# Altium schematic sheet Shutdown.SchDoc
size A
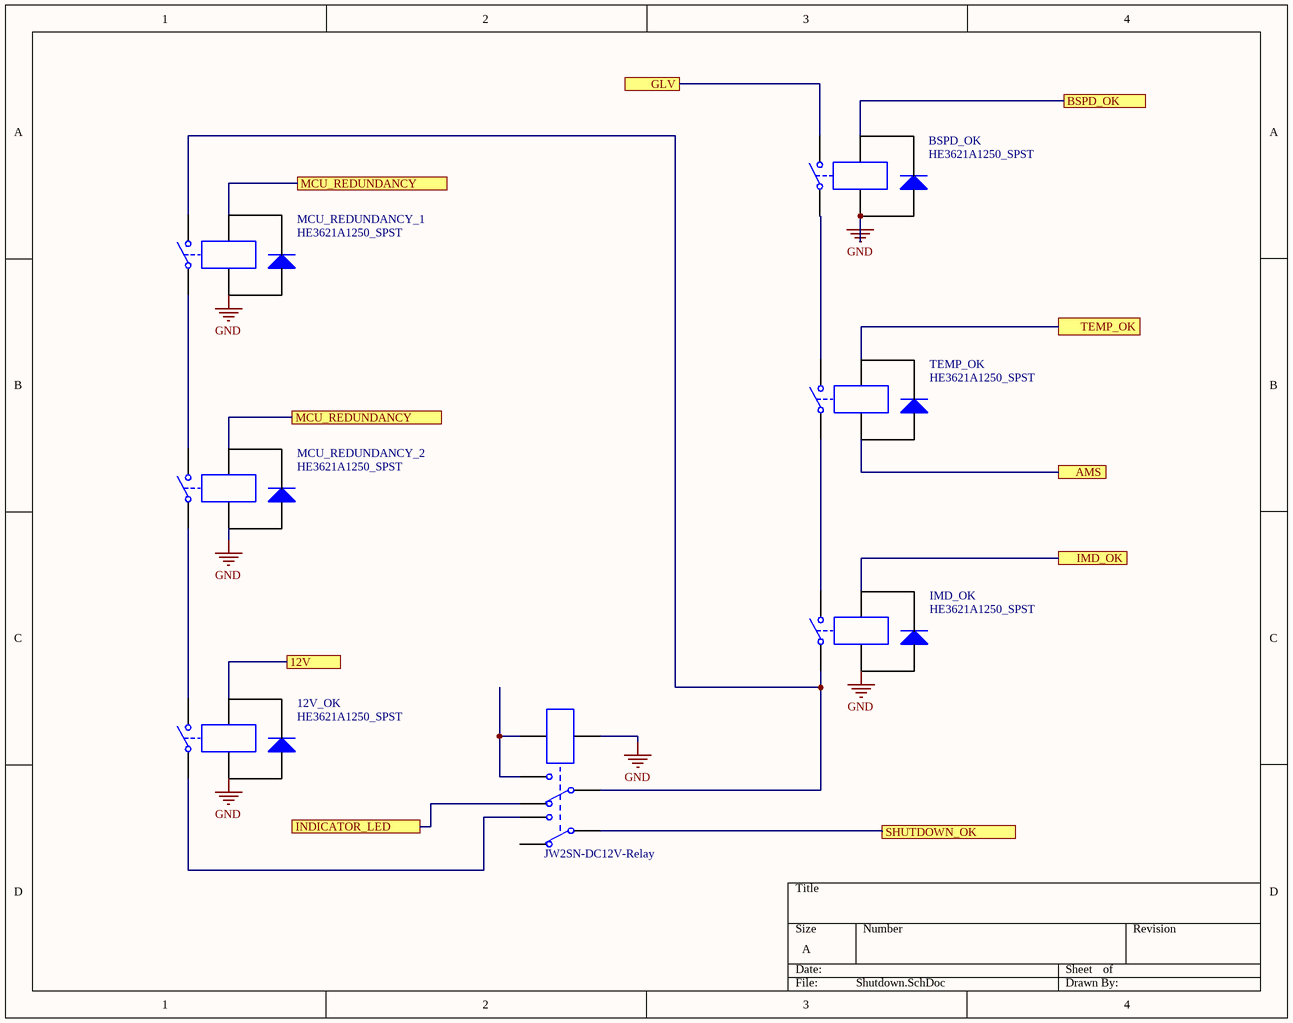
[diagram p0: Shutdown.SchDoc]

## Parts
12V_OK  HE3621A1250_SPST  [SIL]
?  JW2SN-DC12V-Relay  [JW2SN-DC12V-Relay]
BSPD_OK  HE3621A1250_SPST  [SIL]
IMD_OK  HE3621A1250_SPST  [SIL]
MCU_REDUNDANCY_1  HE3621A1250_SPST  [SIL]
MCU_REDUNDANCY_2  HE3621A1250_SPST  [SIL]
TEMP_OK  HE3621A1250_SPST  [SIL]

## Ports
12V, AMS, BSPD_OK, GLV, IMD_OK, INDICATOR_LED, MCU_REDUNDANCY, SHUTDOWN_OK, TEMP_OK

## Nets
GND: 12V_OK.3 ?.1(COIL1) BSPD_OK.3 IMD_OK.3 MCU_REDUNDANCY_1.3 MCU_REDUNDANCY_2.3
12V: 12V_OK.2 ; port 12V
AMS: TEMP_OK.3 ; port AMS
BSPD_OK: BSPD_OK.2 ; port BSPD_OK
GLV: BSPD_OK.1 ; port GLV
IMD_OK: IMD_OK.2 ; port IMD_OK
INDICATOR_LED: ?.2(N.C1) ; port INDICATOR_LED
MCU_REDUNDANCY: MCU_REDUNDANCY_1.2 MCU_REDUNDANCY_2.2 ; port MCU_REDUNDANCY
SHUTDOWN_OK: ?.6(COM2) ; port SHUTDOWN_OK
TEMP_OK: TEMP_OK.2 ; port TEMP_OK
Net12V_OK_1: 12V_OK.1 MCU_REDUNDANCY_2.4
Net12V_OK_4: 12V_OK.4 ?.5(N.O2)
Net?_3: ?.3(COM1) IMD_OK.4 MCU_REDUNDANCY_1.1
Net?_4: ?.4(N.O1) ?.8(COIL2)
NetBSPD_OK_4: BSPD_OK.4 TEMP_OK.1
NetIMD_OK_1: IMD_OK.1 TEMP_OK.4
NetMCU_REDUNDANCY_1_4: MCU_REDUNDANCY_1.4 MCU_REDUNDANCY_2.1

Not connected (* = marked no-connect by the designer): ? 7(N.C2)

## Library data of the parts
12V_OK BSPD_OK IMD_OK MCU_REDUNDANCY_1 MCU_REDUNDANCY_2 TEMP_OK = 1: idRelay: 1; Name: Relay HE3621A1250; Manufacturer_id: 1; Drawer_id: 1
? = 2: Manufacturer_id: 1; idRelay: 2; Name: Relay JW2SN-DC12; Drawer_id: 1